# Altium project BluePhil.PrjPcb
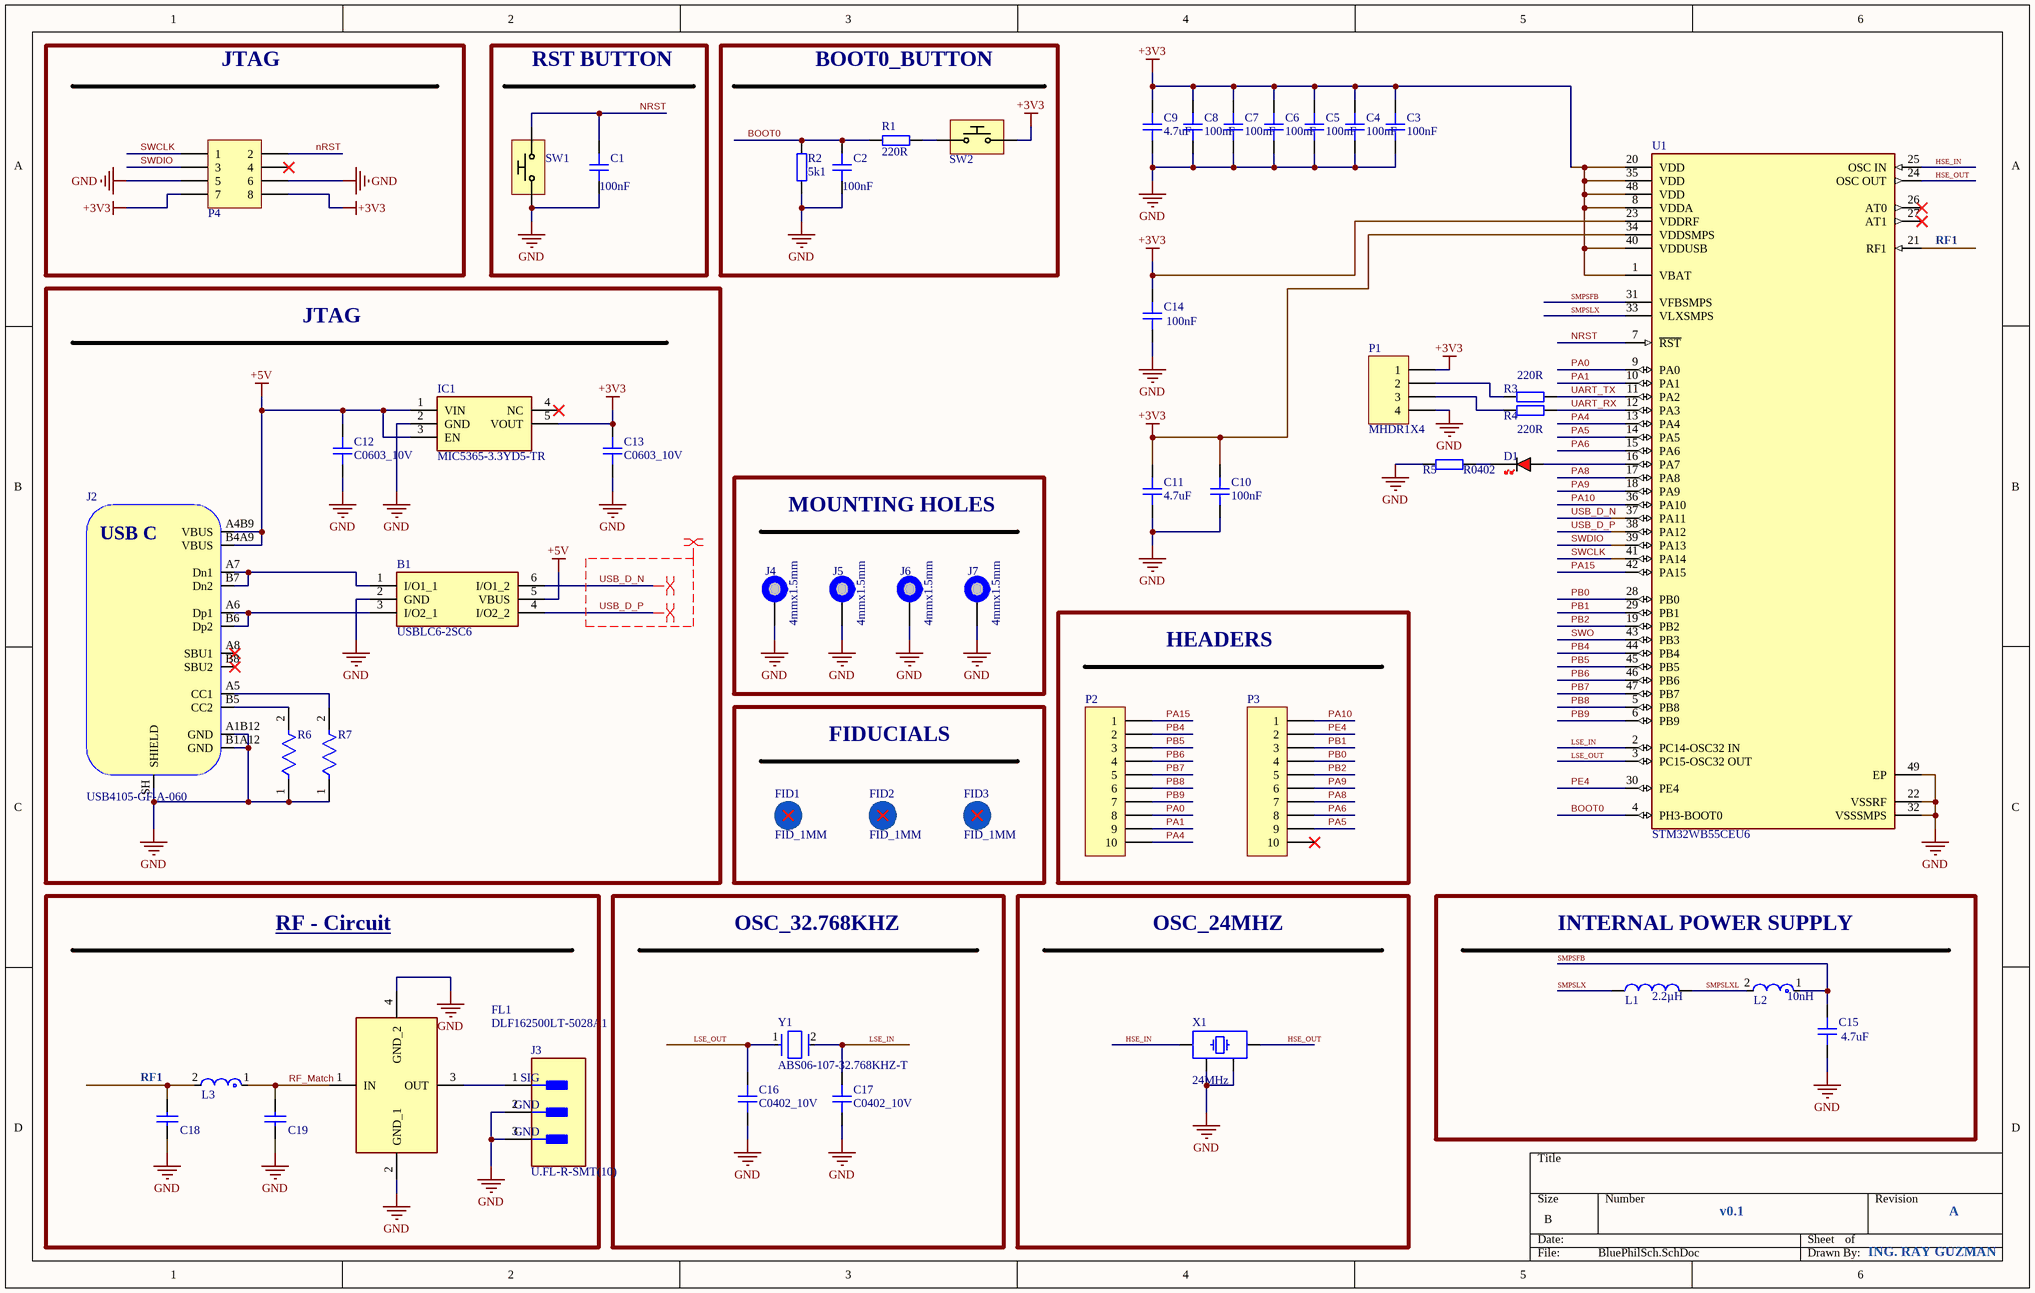
[diagram p0: BluePhilSch.SchDoc]
1 sheet, 51 parts. Net scope: global (net labels, ports and power ports of the same name join across sheets).
Board file: BluePhil.PcbDoc

## Sheet BluePhilSch.SchDoc
size B; SheetNumber: 1; SheetTotal: 1

### Parts
B1  USBLC6-2SC6  [SOT95P280X145-6N]
C1  value 100nF  [CAP_0402]  (hidden comment: C0402_10V)
C2  value 100nF  [CAP_0402]  (hidden comment: C0402_10V)
C3  value 100nF  [CAP_0402]  (hidden comment: C0402_10V)
C4  value 100nF  [CAP_0402]  (hidden comment: C0402_10V)
C5  value 100nF  [CAP_0402]  (hidden comment: C0402_10V)
C6  value 100nF  [CAP_0402]  (hidden comment: C0402_10V)
C7  value 100nF  [CAP_0402]  (hidden comment: C0402_10V)
C8  value 100nF  [CAP_0402]  (hidden comment: C0402_10V)
C9  value 4.7uF  [CAP_0402]  (hidden comment: C0402_10V)
C10  value 100nF  [CAP_0402]  (hidden comment: C0402_10V)
C11  value 4.7uF  [CAP_0402]  (hidden comment: C0402_10V)
C12  C0603_10V  [CAP_0603]
C13  C0603_10V  [CAP_0603]
C14  value 100nF  [CAP_0402]  (hidden comment: C0402_10V)
C15  value 4.7uF  [CAP_0402]  (hidden comment: C0402_10V)
C16  C0402_10V  [CAP_0402]
C17  C0402_10V  [CAP_0402]
C18  GRM1555C1HR80BA01D  [CAPC1005X55X25LL05T10]  (value not drawn)
C19  GRM1555C1HR30WA01D  [CAPC1005X55X25NL05T10]  (value not drawn)
D1  RED  [LED_0603_RED]  (value not drawn)
FID1  FID_1MM  [FID_40X120D]
FID2  FID_1MM  [FID_40X120D]
FID3  FID_1MM  [FID_40X120D]
FL1  DLF162500LT-5028A1  [DLF162500LT5028A1]
IC1  MIC5365-3.3YD5-TR  [SOT95P280X100-5N]
J2  USB4105-GF-A-060  [USB4105-GF-A-060]
J3  U.FL-R-SMT(10)  [FP-U_FL-R-SMT_10-MFG]
J4  4mmx1.5mm  [PAD_WITH_HOLE_4mmx1.5mm]  (no BOM)
J5  4mmx1.5mm  [PAD_WITH_HOLE_4mmx1.5mm]  (no BOM)
J6  4mmx1.5mm  [PAD_WITH_HOLE_4mmx1.5mm]  (no BOM)
J7  4mmx1.5mm  [PAD_WITH_HOLE_4mmx1.5mm]  (no BOM)
L1  Inductance: 2.2µH  [WE-PMI_0805_L2W1.2H0.5]  (hidden comment: 74479774222)
L2  Inductance: 10nH  [FP-LQG15WH_02-MFG]  (hidden comment: LQG15WZ10NJ02D)
L3  LQG15HS2N7S02D  [FP-LQG15HH_02-IPC_C]  (value not drawn)
P1  MHDR1X4  [MHDR1X4body]
P2  Header 10  [MY_MA10-1]  (value not drawn)
P3  Header 10  [MY_MA10-1]  (value not drawn)
P4  Header 4X2  [My_2X4]  (value not drawn)
R1  220R  [RES_0402]
R2  5k1  [RES_0402]
R3  220R  [RES_0402]
R4  220R  [RES_0402]
R5  R0402  [RES_0402]
R6  ERJ-2RKF5101X  [FP-ERJ2RK-IPC_A]  (value not drawn)
R7  ERJ-2RKF5101X  [FP-ERJ2RK-IPC_A]  (value not drawn)
SW1  Tactile Switch  [PTS815]  (value not drawn)
SW2  Tactile Switch  [PTS815]  (value not drawn)
U1  STM32WB55CEU6  [FP-UFQFPN48-A0B9-MFG]
X1  24MHz  [XTAL_3225]
Y1  ABS06-107-32.768KHZ-T  [FP-ABS06-MFG]

### Blocks framed on the sheet
JTAG: P4
RST BUTTON: C1 SW1
BOOT0_BUTTON: C2 R1 R2 SW2
JTAG: B1 C12 C13 IC1 J2 R6 R7
MOUNTING HOLES: J4-J7
HEADERS: P2 P3
FIDUCIALS: FID1-FID3
RF - Circuit: C18 C19 FL1 J3 L3
OSC_32.768KHZ: C16 C17 Y1
OSC_24MHZ: X1
INTERNAL POWER SUPPLY: C15 L1 L2

### Nets
+3V3: C3.1 C4.1 C5.1 C6.1 C7.1 C8.1 C9.1 C10.1 C11.1 C13.2 C14.1 IC1.5(VOUT) P1.1 P4.7 P4.8 SW2.2 U1.1(VBAT) U1.8(VDDA) U1.20(VDD) U1.23(VDDRF) U1.34(VDDSMPS) U1.35(VDD) U1.40(VDDUSB) U1.48(VDD)
+5V: B1.5(VBUS) C12.2 IC1.1(VIN) IC1.3(EN) J2.A4B9(VBUS) J2.B4A9(VBUS)
GND: B1.2(GND) C1.2 C2.2 C3.2 C4.2 C5.2 C6.2 C7.2 C8.2 C9.2 C10.2 C11.2 C12.1 C13.1 C14.2 C15.2 C16.1 C17.1 C18.1 C19.2 FL1.2(GND_1) FL1.4(GND_2) IC1.2(GND) J2.A1B12(GND) J2.B1A12(GND) J2.SH(SHIELD) J3.2(GND) J3.3(GND) J4.1 J5.1 J6.1 J7.1 P1.4 P4.5 P4.6 R2.2 R5.1 R6.1 R7.1 SW1.1 U1.22(VSSRF) U1.32(VSSSMPS) U1.49(EP) X1.2 X1.4
BOOT0: C2.1 R1.1 R2.1 U1.4(PH3-BOOT0)
HSE_IN: U1.25(OSC_IN) X1.1
HSE_OUT: U1.24(OSC_OUT) X1.3
LSE_IN: C17.2 U1.2(PC14-OSC32_IN) Y1.2
LSE_OUT: C16.2 U1.3(PC15-OSC32_OUT) Y1.1
NRST: C1.1 P4.2 SW1.2 U1.7(~{RST})
PA0: P2.8 U1.9(PA0)
PA1: P2.9 U1.10(PA1)
PA4: P2.10 U1.13(PA4)
PA5: P3.9 U1.14(PA5)
PA6: P3.8 U1.15(PA6)
PA8: P3.7 U1.17(PA8)
PA9: P3.6 U1.18(PA9)
PA10: P3.1 U1.36(PA10)
PA15: P2.1 U1.42(PA15)
PB0: P3.4 U1.28(PB0)
PB1: P3.3 U1.29(PB1)
PB2: P3.5 U1.19(PB2)
PB4: P2.2 U1.44(PB4)
PB5: P2.3 U1.45(PB5)
PB6: P2.4 U1.46(PB6)
PB7: P2.5 U1.47(PB7)
PB8: P2.6 U1.5(PB8)
PB9: P2.7 U1.6(PB9)
PE4: P3.2 U1.30(PE4)
RF1: C18.2 L3.2 U1.21(RF1)
RF_Match: C19.1 FL1.1(IN) L3.1
SMPSFB: C15.1 L2.1 U1.31(VFBSMPS)
SMPSLX: L1.2 U1.33(VLXSMPS)
SMPSLXL: L1.1 L2.2
SWCLK: P4.1 U1.41(PA14)
SWDIO: P4.3 U1.39(PA13)
SWO: U1.43(PB3)
UART_RX: R4.2 U1.12(PA3)
UART_TX: R3.2 U1.11(PA2)
USB_D_N: B1.6(I/O1_2) U1.37(PA11)
USB_D_P: B1.4(I/O2_2) U1.38(PA12)
NetB1_1: B1.1(I/O1_1) J2.A7(Dn1) J2.B7(Dn2)
NetB1_3: B1.3(I/O2_1) J2.A6(Dp1) J2.B6(Dp2)
NetD1_A: D1.A U1.16(PA7)
NetD1_K: D1.K R5.2
NetFL1_3: FL1.3(OUT) J3.1(SIG)
NetJ2_A5: J2.A5(CC1) R7.2
NetJ2_B5: J2.B5(CC2) R6.2
NetP1_2: P1.2 R3.1
NetP1_3: P1.3 R4.1
NetR1_2: R1.2 SW2.1

Not connected (* = marked no-connect by the designer): IC1 4(NC)*; J2 A8(SBU1)* B8(SBU2)*; P3 10*; P4 4*; U1 26(AT0)* 27(AT1)*

### Layout directives
differential pair; differential pair class USB: USB_D_N, USB_D_P
net class USB: USB_D_N, USB_D_P

### Notes on the sheet
- v0.1
- A
- ING. RAY GUZMAN
- (in symbol USB4105-GF-A-060) USB C

### Library data of the parts
B1 = USBLC6-2SC6: TVS Diode Array Uni-Directional USBLC6-2SC6 17V, SOT-23 6-Pin; Manufacturer_Name: STMicroelectronics; Geometry.Height: 1.45mm; Mouser Part Number: 511-USBLC6-2SC6; Mouser Price/Stock: https://www.mouser.co.uk/ProductDetail/STMicroelectronics/USBLC6-2SC6?qs=po45yt2pPpu%2FhNIlwQdTlg%3D%3D; Manufacturer_Part_Number: USBLC6-2SC6; Datasheet Link: http://www.st.com/st-web-ui/static/active/en/resource/technical/document/datasheet/CD00050750.pdf
C1-C11 C14-C17 = CAP_0402_10V: Capacitor SMD 0402 10V
C12 C13 = CAP_0603_10V: Capacitor SMD 0603 10V
C18 = CMP-1034-00043-2: Manufacturer: Murata; Part Number: GRM1555C1HR80BA01D
C19 = CMP-1034-00007-2: Manufacturer: Murata; Part Number: GRM1555C1HR30WA01D
D1 = LED_0603_RED: LED 0603 RED SMD
FL1 = DLF162500LT-5028A1: Filter; Manufacturer_Name: TDK; Datasheet Link: https://product.tdk.com/system/files/dam/doc/product/rf/rf/filter/catalog/rf_lpf_dlf162500lt-5028a1_en.pdf; Height: 0.4mm; Manufacturer_Part_Number: DLF162500LT-5028A1; Mouser Part Number: 810-DLF16250LT5028A1; Mouser Price/Stock: https://www.mouser.co.uk/ProductDetail/TDK/DLF162500LT-5028A1?qs=U%2FZX79kHR%2FlwIbAISCs3qA%3D%3D; Arrow Part Number: DLF162500LT-5028A1; Arrow Price/Stock: https://www.arrow.com/en/products/dlf162500lt-5028a1/tdk?region=europe
IC1 = MIC5365-3.3YD5-TR: Integrated Circuit; Manufacturer_Name: Microchip; Datasheet Link: https://ww1.microchip.com/downloads/en/DeviceDoc/mic5365.pdf; Height: 1mm; Manufacturer_Part_Number: MIC5365-3.3YD5-TR; Mouser Part Number: 998-MIC5365-3.3YD5TR; Mouser Price/Stock: https://www.mouser.co.uk/ProductDetail/Microchip-Technology/MIC5365-3.3YD5-TR?qs=U6T8BxXiZAXzRinbbfZRrg%3D%3D; Arrow Part Number: MIC5365-3.3YD5-TR; Arrow Price/Stock: https://www.arrow.com/en/products/mic5365-3.3yd5-tr/microchip-technology?region=nac
J2 = USB4105-GF-A-060: USB Connector Type C SMT 12 Pin; Manufacturer: GCT; Manufacturer Part Number: USB4105-GF-A-060
J3 = CMP-0029-00003-2: CONN U.FL RCPT STR 50 OHM SMD; Plating: Silver; Connector Type: Coaxial; Frequency: 6GHz; Impedance: 50R; Body Material: Bronze; Dielectric Material: Polymer; Contact Plating: Gold; Termination: Solder; Orientation: Vertical; Contact Material: Brass; Min Operating Temperature: -40°C; Mount: Surface Mount; Lead Free: Lead Free; Max Operating Temperature: 90°C; Radiation Hardening: No; Packaging: Tape and Reel; Body Plating: Silver; Fastening Type: Snap; Max Frequency: 6GHz; Depth: 3.1mm; Package Quantity: 1; Case/Package: SMD/SMT; Housing Color: Beige; Length: 3mm
J4-J7 = PAD_WITH_HOLE_4mmx1.5mm
L1 = CMP-1392-00044-3: NexarPartId: 23392509; Series Resistance: 425mΩ; DC Resistance (DCR): 340mΩ; Test Frequency: 1MHz; Q Factor: 15; Inductance Tolerance: 20%; RMS Current (Irms): 700mA; Self Resonant Frequency: 40MHz; Saturation Current: 250mA; RoHS: Compliant; Width: 1.25mm; Min Operating Temperature: -40°C; Max Operating Temperature: 125°C; Ambient Temperature Range High: 85°C; Current Rating: 700mA; Number of Pins: 2; Ambient Temperature Range Low: -40°C; Tolerance: 20%; Case/Package: 0805; Packaging: Digi-Reel®; Length: 2mm; Height: 500µm
L2 = CMP-06042-005237-1: Multilayer type Inductor for Automotive 10nH ±5% 0.19Ω 500mA 0402; Core Material: Air; Test Frequency: 100MHz; DC Resistance (DCR): 190mR; Shielding: Unshielded; Self Resonant Frequency: 3.3GHz; Min Operating Temperature: -55°C; Tolerance: 5%; Max Operating Temperature: 125°C; Packaging: Cut Tape; Current Rating: 500mA; Case Code (Metric): 1005; Mount: Surface Mount; Case/Package: 0402; Ratings: AEC-Q200; Case Code (Imperial): 0402
L3 = CMP-2000-06580-2: Multilayer type RF Inductor 2.7nH ±0.3nH 0.12Ω 800mA 0402; Max DC Current: 300mA; Q Factor: 8; Core Material: Air; Test Frequency: 100MHz; Shielding: Unshielded; Self Resonant Frequency: 6GHz; DC Resistance (DCR): 150mR; Packaging: Tape and Reel; Depth: 0.55mm; DC Current: 300mA; Length: 1mm; Current Rating: 300mA; Lead Free: Lead Free; Max Operating Temperature: 125°C; Mount: Surface Mount; Height - Seated (Max): 0.022inch; Case Code (Imperial): 0402; Height: 0.5mm; Termination: SMD/SMT; Package Quantity: 10000; Radiation Hardening: No; Width: 0.5mm; Case Code (Metric): 1005; Min Operating Temperature: -55°C; Military Standard: Not; Case/Package: 0402; Inductance: 2.7nH
P1 = MHDR1X4: Header, 4-Pin; LatestRevisionDate: 17-Jul-2002; LatestRevisionNote: Re-released for DXP Platform.; Publisher: Altium Limited
P2 P3 = Header 10: Header, 10-Pin; ASiD Part Number: Header 10-AS
P4 = Header 4X2: Header, 8-Pin, Dual row; ASiD Part Number: Header 4X2-AS
R1-R5 = RES_0402: Resistor SMD 0402; Manufacturer: *; Manufacturer Part Number: *; Distributor Link: *
R6 R7 = CMP-2002-01158-2: RES SMD 5.1K OHM 1% 1/10W 0402; Voltage Rating: 50V; Temperature Coefficient: 100ppm/°C; Resistance: 5.1kR; Power Rating: 100mW; Min Operating Temperature: -55°C; Technology: THICK FILM; Military Standard: Not; Depth: 0.5mm; Contact Plating: Tin; Tolerance: 1%; Construction: Rectangular; Length: 1mm; Case/Package: 0402; Lead Free: Lead Free; RoHS Compliant: Yes; Termination: SMD/SMT; Height: 0.35mm; Max Operating Temperature: 155°C; Case Code (Imperial): 0402; Number of Terminations: 2; Packaging: Tape and Reel; Case Code (Metric): 1005; Width: 0.5mm; Max Power Dissipation: 100mW; Package Quantity: 10000; Resistance Tolerance: 1%; REACH SVHC: No SVHC; Mount: Surface Mount; Series: ERJ; Voltage Rating (DC): 50V; Weight: 2.8E-05oz; Resistor Type: Thick Film
SW1 SW2 = PTS815-SJM-250-SMTR-LFS: Tactile Switches Tact Switch, 12 VDC, 50 mA, 4.2x3.2, 2.5mm H, 180gf, J leadspp SPST; Manufacturer: C&K Switches; Manufacturer Part Number: PTS815 SJM 250 SMTR LFS
U1 = CMP-12160-000002-1: ULTRA-LOW-POWER DUAL CORE ARM CO; Manufacturer: STMicroelectronics; Max Junction Temp: +125°C; Data Rate: 2Mbits/s; Number Of Gpio: 30; Max Supply Voltage: 3.6V; Min Supply Voltage: 1.71V; Number Of Adc Channels: 13; Standoff Height: 0mm; Bandwidth: 2402-2480MHz; Max Frequency: 2480MHz; Interface: I2C,SPI,UART,USART,USB,Other; Max Power Dissipation: 392mW; Sensitivity: -100dBm; Temperature Range Low: -40°C; Digikey Description: ULTRA-LOW-POWER DUAL CORE ARM CO; Package: UFQFPN48-A0B9; ComponentLink2URL: https://www.st.com/resource/en/datasheet/stm32wb55rg.pdf; Ambient Temperature Range Low: -40°C; Automotive: No; Lead Free: Yes; RoHS: TRUE; Height: 0.65mm; Device Class L1: Integrated Circuits (ICs); Octopart: https://octopart.com/stm32wb55ceu6-stmicroelectronics-96611730; Device Class L2: RF Semiconductors and Devices; Ambient Temperature Range High: +105°C; Ipc Land Pattern Name: QFN50P700X700X57-48; Device Class L3: Transceivers; Category: IC; Temperature: -40°C to +125°C; ComponentLink2Description: Datasheet; Manufacturer Part Number: STM32WB55CEU6; Temperature Range High: +125°C
X1 = TSX-3225_24.0000MF15X-AC: Crystal SMD 24MHz 10PPM 7pF 3225; Manufacturer: Epson; Manufacturer Part Number: TSX-3225 24.0000MF15X-AC
Y1 = CMP-2000-05734-3: Crystal 32.768kHz ±20ppm (Tol) 4pF FUND 60kΩ 2-Pin Mini-CSMD T/R; Frequency Stability: 175ppm; ESR (Equivalent Series Resistance): 60kR; Series Resistance: 80kR; Radiation Hardening: No; Case Code (Metric): 2012; Frequency: 32.768kHz; Lead Free: Lead Free; Series: ABS06; Package Quantity: 3000; Number of Pins: 2; Length: 2mm; Max Operating Temperature: 85°C; Case/Package: SMD/SMT; Packaging: Tape and Reel; Mount: Surface Mount; Min Operating Temperature: -40°C; Frequency Tolerance: 20ppm; Tolerance: 20ppm; Case Code (Imperial): 0805; Width: 1.2mm; Termination: SMD/SMT; RoHS Compliant: Yes; Load Capacitance: 4pF; Height: 0.6mm